# EAGLE schematic motor (EAGLE 7.2.0)
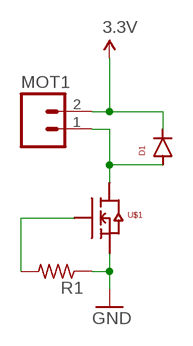
[diagram p0: schematic, sheet 1]

## Parts
D1  DIODE  [DIODE]
MOT1  M02PTH  [1X02]
R1  R-US_R0805  [R0805]
U$1  FET  [FET]

## Nets
3.3V: D1.P$NEG MOT1.2
GND: R1.1 U$1.P$2
N$2: D1.P$POS MOT1.1 U$1.P$3
N$3: R1.2 U$1.P$1

## Library data of the parts
D1 = copter_components:DIODE
MOT1 = Lab5:M02: Header 2 Standard 2-pin 0.1" header. Use with straight break away headers (SKU : PRT-00116), right angle break away headers (PRT-00553), swiss pins (PRT-00743), machine pins (PRT-00117), and female headers (PRT-00115). Molex polarized connector foot print use with SKU : PRT-08233 with associated crimp pins and housings.
R1 = Lab5:R-US_: RESISTOR, American symbol
U$1 = copter_components:FET